# Altium schematic sheet 电路图.SchDoc
size A3; PageSetup: Record=PageOptions|CenterHorizontal=True|CenterVertical=True|PrintScale=1.00|XCorrection=1.00|YCorrection=1.00|PrintKind=1|BorderSize=5000000|LeftOffset=0|BottomOffset=0|Orientation=2|PaperLength=1000|PaperWidth=1000|Scale=100|PaperSource=7|PrintQuality=-3|MediaType=1|DitherType=10|PrintScaleMode=0|PaperKind=A4|PaperIndex=9
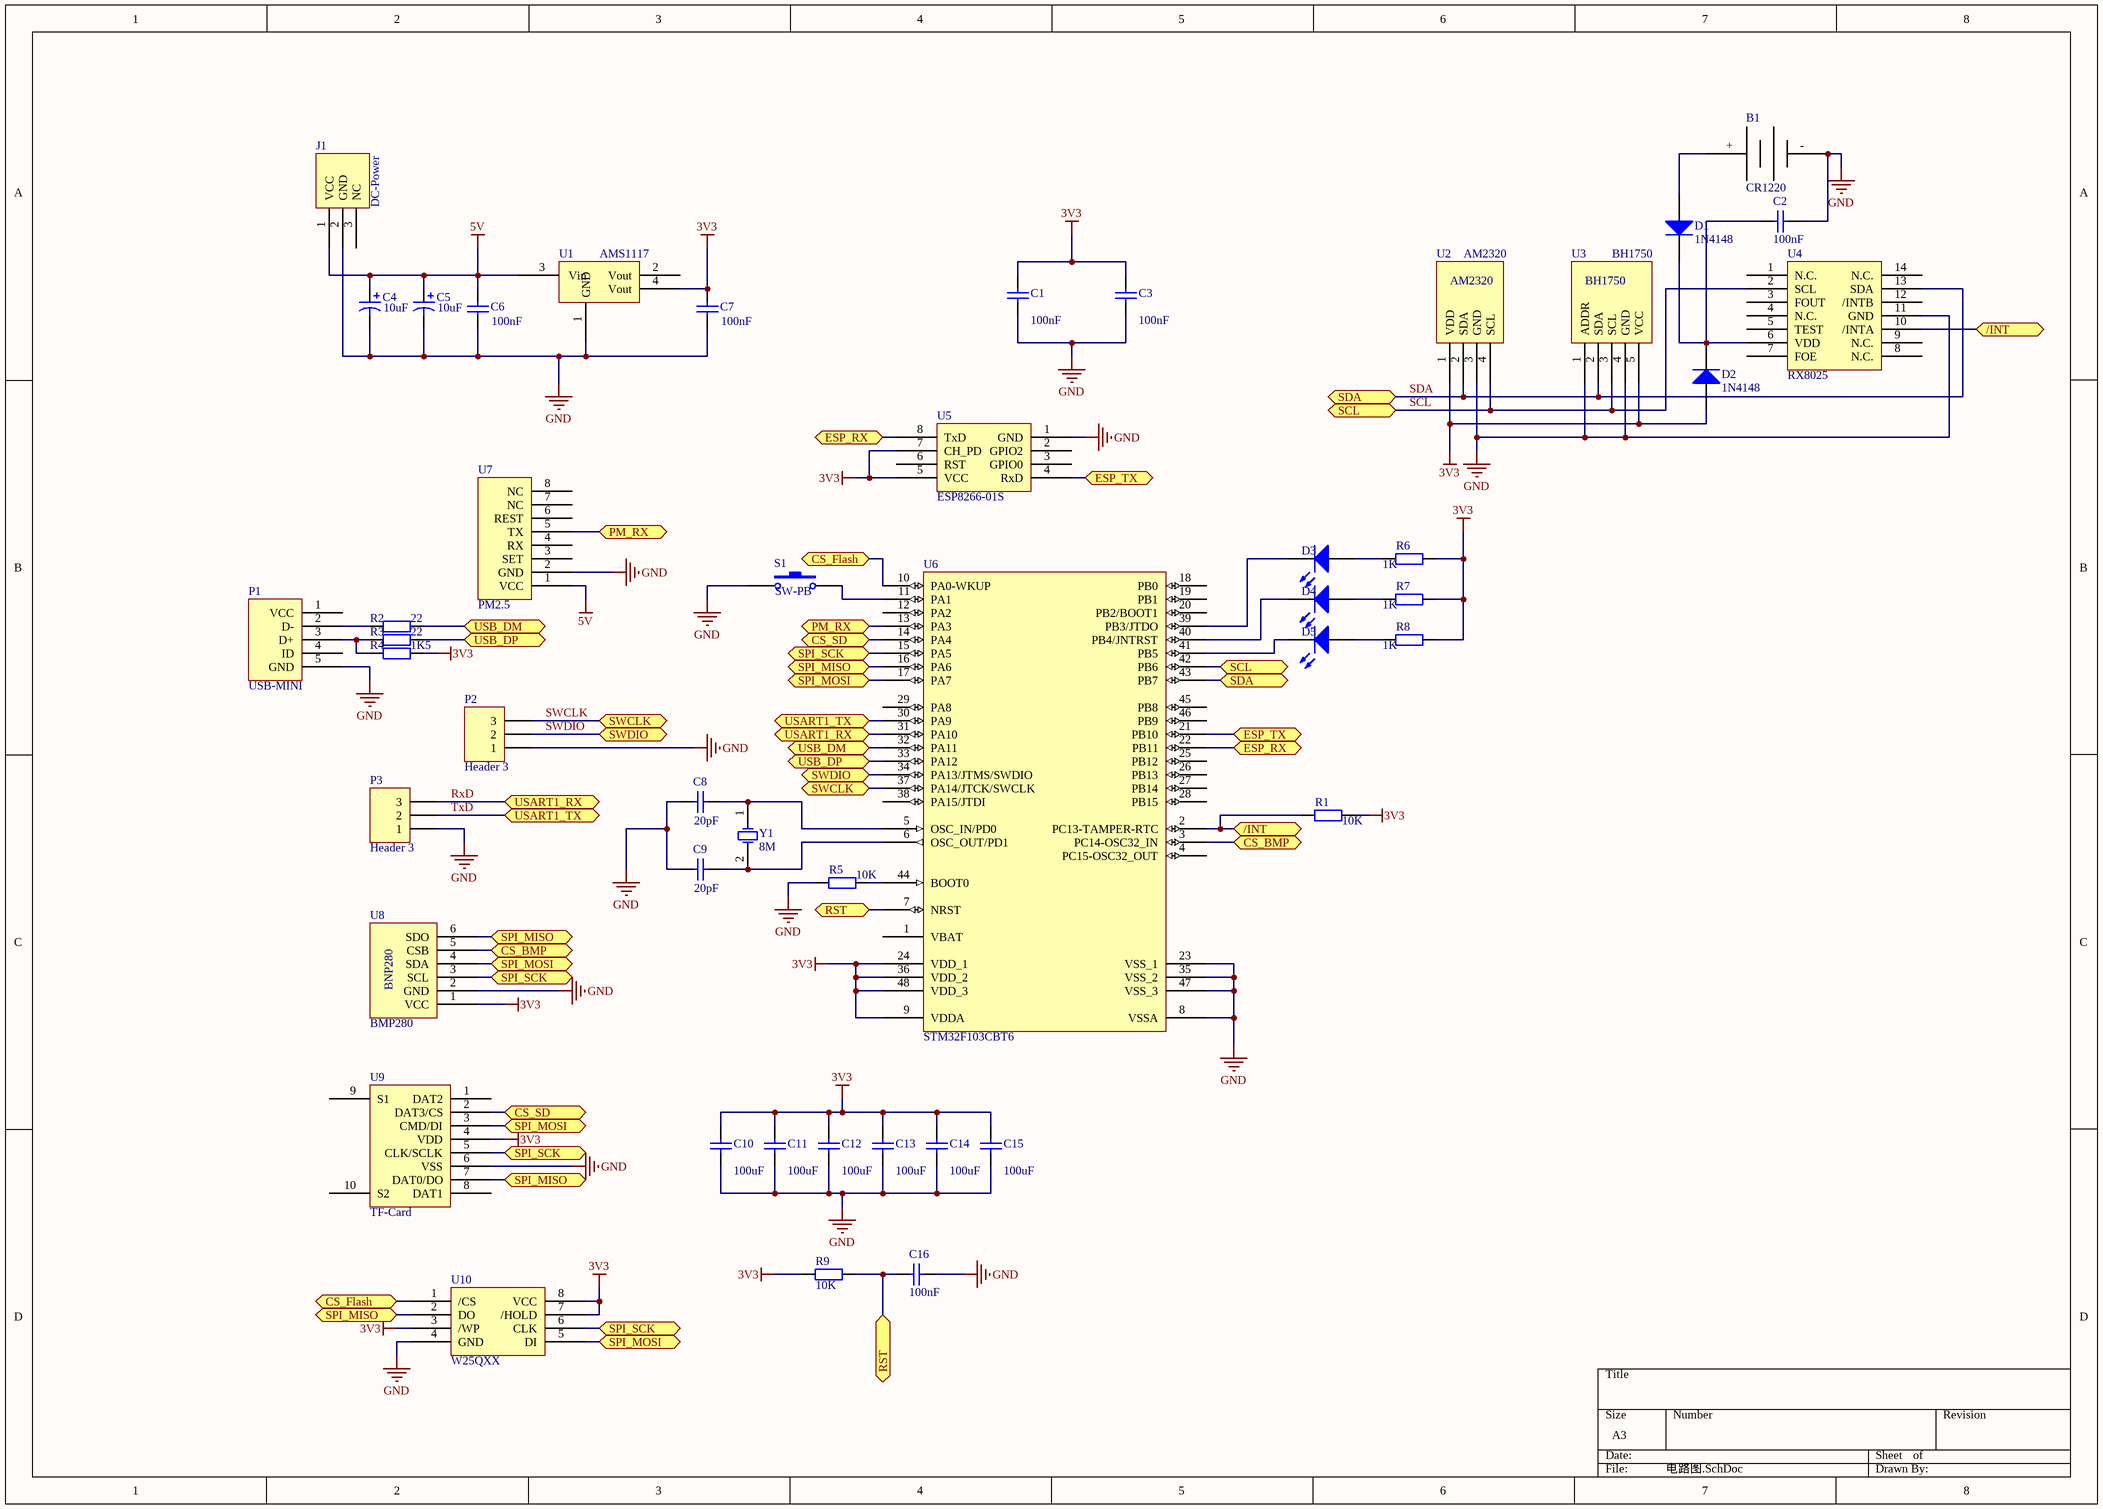
[diagram p0: 电路图.SchDoc]

## Parts
B1  CR1220  [CR1220]
C1  value 100nF  [1608[0603]]  (hidden comment: Cap)
C2  value 100nF  [1608[0603]]  (hidden comment: Cap)
C3  value 100nF  [1608[0603]]  (hidden comment: Cap)
C4  value 10uF  [C1210]  (hidden comment: Cap Pol1)
C5  value 10uF  [C1210]  (hidden comment: Cap Pol1)
C6  value 100nF  [1608[0603]]  (hidden comment: Cap)
C7  value 100nF  [1608[0603]]  (hidden comment: Cap)
C8  value 20pF  [C0805]  (hidden comment: Cap)
C9  value 20pF  [C0805]  (hidden comment: Cap)
C10  value 100uF  [1608[0603]]  (hidden comment: Cap)
C11  value 100uF  [1608[0603]]  (hidden comment: Cap)
C12  value 100uF  [1608[0603]]  (hidden comment: Cap)
C13  value 100uF  [1608[0603]]  (hidden comment: Cap)
C14  value 100uF  [1608[0603]]  (hidden comment: Cap)
C15  value 100uF  [1608[0603]]  (hidden comment: Cap)
C16  value 100nF  [1608[0603]]  (hidden comment: Cap)
D1  1N4148  [DO-35]
D2  1N4148  [DO-35]
D3  LED2  [C0805]  (value not drawn)
D4  LED2  [C0805]  (value not drawn)
D5  LED2  [C0805]  (value not drawn)
J1  DC-Power  [DC-Power]
P1  USB-MINI  [USB-MINI]
P2  Header 3  [HDR1X3]
P3  Header 3  [HDR1X3]
R1  value 10K  [1608[0603]]  (hidden comment: Res2)
R2  value 22  [C0805]  (hidden comment: Res2)
R3  value 22  [C0805]  (hidden comment: Res2)
R4  value 1K5  [C0805]  (hidden comment: Res2)
R5  value 10K  [1608[0603]]  (hidden comment: Res2)
R6  value 1K  [1608[0603]]  (hidden comment: Res2)
R7  value 1K  [1608[0603]]  (hidden comment: Res2)
R8  value 1K  [1608[0603]]  (hidden comment: Res2)
R9  value 10K  [1608[0603]]  (hidden comment: Res2)
S1  SW-PB  [KEY]
U1  AMS1117  [SOT223_N]
U2  AM2320  [HDR1X4]
U3  BH1750  [HDR1X5]
U4  RX8025  [SOP14]
U5  ESP8266-01S  [ESP-8P]
U6  STM32F103CBT6  [LQFP48_L]
U7  PM2.5  [PT-8P]
U8  BMP280  [HDR1X6]
U9  TF-Card  [TF-Card]
U10  W25QXX  [SOIC8]
Y1  8M  [OSC]

## Ports
/INT, CS_BMP, CS_Flash, CS_SD, ESP_RX, ESP_TX, PM_RX, RST, SCL, SDA, SPI_MISO, SPI_MOSI, SPI_SCK, SWCLK, SWDIO, USART1_RX, USART1_TX, USB_DM, USB_DP

## Nets
3V3: C1.2 C3.2 C7.2 C10.2 C11.2 C12.2 C13.2 C14.2 C15.2 D2.1(A) R1.2 R4.1 R6.2 R7.2 R8.2 R9.2 U1.4(Vout) U2.1(VDD) U3.5(VCC) U5.5(VCC) U5.7(CH_PD) U6.9(VDDA) U6.24(VDD_1) U6.36(VDD_2) U6.48(VDD_3) U8.1(VCC) U9.4(VDD) U10.3(/WP) U10.7(/HOLD) U10.8(VCC)
5V: C4.1 C5.1 C6.2 J1.1(VCC) U1.3(Vin) U7.1(VCC)
GND: B1.- C1.1 C2.1 C3.1 C4.2 C5.2 C6.1 C7.1 C8.1 C9.1 C10.1 C11.1 C12.1 C13.1 C14.1 C15.1 C16.1 J1.2(GND) P1.5(GND) P2.1 P3.1 R5.1 S1.1 U1.1(GND) U2.3(GND) U3.1(ADDR) U3.4(GND) U4.11(GND) U5.1(GND) U6.8(VSSA) U6.23(VSS_1) U6.35(VSS_2) U6.47(VSS_3) U7.2(GND) U8.2(GND) U9.6(VSS) U10.4(GND)
/INT: R1.1 U4.10(/INTA) U6.2(PC13-TAMPER-RTC) ; port /INT
CS_BMP: U6.3(PC14-OSC32_IN) U8.5(CSB) ; port CS_BMP
CS_Flash: U6.10(PA0-WKUP) U10.1(/CS) ; port CS_Flash
CS_SD: U6.14(PA4) U9.2(DAT3/CS) ; port CS_SD
ESP_RX: U5.8(TxD) U6.22(PB11) ; port ESP_RX
ESP_TX: U5.4(RxD) U6.21(PB10) ; port ESP_TX
PM_RX: U6.13(PA3) U7.5(TX) ; port PM_RX
RST: C16.2 R9.1 U6.7(NRST) ; port RST
RxD: P3.3 U6.31(PA10) ; port USART1_RX
SCL: U2.4(SCL) U3.3(SCL) U4.2(SCL) U6.42(PB6) ; port SCL
SDA: U2.2(SDA) U3.2(SDA) U4.13(SDA) U6.43(PB7) ; port SDA
SPI_MISO: U6.16(PA6) U8.6(SDO) U9.7(DAT0/DO) U10.2(DO) ; port SPI_MISO
SPI_MOSI: U6.17(PA7) U8.4(SDA) U9.3(CMD/DI) U10.5(DI) ; port SPI_MOSI
SPI_SCK: U6.15(PA5) U8.3(SCL) U9.5(CLK/SCLK) U10.6(CLK) ; port SPI_SCK
SWCLK: P2.3 U6.37(PA14/JTCK/SWCLK) ; port SWCLK
SWDIO: P2.2 U6.34(PA13/JTMS/SWDIO) ; port SWDIO
TxD: P3.2 U6.30(PA9) ; port USART1_TX
USB_DM: R2.2 U6.32(PA11) ; port USB_DM
USB_DP: R3.2 U6.33(PA12) ; port USB_DP
NetB1_+: B1.+ D1.1(A)
NetC2_2: C2.2 D1.2(K) D2.2(K) U4.6(VDD)
NetC8_2: C8.2 U6.5(OSC_IN/PD0) Y1.1(OSC1)
NetC9_2: C9.2 U6.6(OSC_OUT/PD1) Y1.2(OSC2)
NetD3_1: D3.1(A) R6.1
NetD3_2: D3.2(K) U6.39(PB3/JTDO)
NetD4_1: D4.1(A) R7.1
NetD4_2: D4.2(K) U6.40(PB4/JNTRST)
NetD5_1: D5.1(A) R8.1
NetD5_2: D5.2(K) U6.41(PB5)
NetP1_2: P1.2(D-) R2.1
NetP1_3: P1.3(D+) R3.1 R4.2
NetR5_2: R5.2 U6.44(BOOT0)
NetS1_2: S1.2 U6.11(PA1)

Not connected (* = marked no-connect by the designer): J1 3(NC); P1 1(VCC) 4(ID); U1 2(Vout); U4 1(N.C.) 3(FOUT) 4(N.C.) 5(TEST) 7(FOE) 8(N.C.) 9(N.C.) 12(/INTB) 14(N.C.); U5 2(GPIO2) 3(GPIO0) 6(RST); U6 1(VBAT) 4(PC15-OSC32_OUT) 12(PA2) 18(PB0) 19(PB1) 20(PB2/BOOT1) 25(PB12) 26(PB13) 27(PB14) 28(PB15) 29(PA8) 38(PA15/JTDI) 45(PB8) 46(PB9); U7 3(SET) 4(RX) 6(REST) 7(NC) 8(NC); U9 1(DAT2) 8(DAT1) 9(S1) 10(S2)

## Notes on the sheet
- (in symbol BMP280) BNP280

## Library data of the parts
B1 = CR1220: CR1220电池; pin to pad: +>1 ->2
C1-C3 C6-C16 = Cap: Capacitor; Published: 8-Jun-2000; LatestRevisionDate: 17-Jul-2002; LatestRevisionNote: Re-released for DXP Platform.; PackageReference: RAD-0.3; Publisher: Altium Limited; PackageDescription: Radial Cap, Thru-Hole; 2 Leads; 0.3 in Pin Spacing
C4 C5 = Cap Pol1: Polarized Capacitor (Radial); Published: 8-Jun-2000; LatestRevisionDate: 17-Jul-2002; LatestRevisionNote: Re-released for DXP Platform.; PackageReference: RB7.6-15; Publisher: Altium Limited; PackageDescription: Polarized Capacitor (Radial); 2 Leads
D1 D2 = Diode 1N4148: High Conductance Fast Diode; Published: 8-Jun-2000; LatestRevisionDate: 17-Jul-2002; LatestRevisionNote: Re-released for DXP Platform.; DatasheetVersion: 1997; PackageReference: DO-35; Publisher: Altium Limited; PackageDescription: Diode, Axial; Body 3.8 x 1.9 mm (LxDia. max), Lead Dia. 0.53 mm (max); Code_JEDEC: DO-204-AH; ComponentLink1Description: Manufacturer Link; ComponentLink1URL: http://www.fairchildsemi.com/; ComponentLink2Description: Datasheet; ComponentLink2URL: http://www.fairchildsemi.com/ds/1N%2F1N4148.pdf
D3-D5 = LED2: Typical RED, GREEN, YELLOW, AMBER GaAs LED; Published: 8-Jun-2000; LatestRevisionDate: 17-Jul-2002; LatestRevisionNote: Re-released for DXP Platform.; PackageVersion: Feb-2002; PackageReference: 3.2X1.6X1.1; Publisher: Altium Limited; PackageDescription: SM LED; 2 Flat Leads
P1 = USB-MINI: USB接口
P2 P3 = Header 3: Header, 3-Pin; LatestRevisionDate: 17-Jul-2002; LatestRevisionNote: Re-released for DXP Platform.; Publisher: Altium Limited
R1-R9 = Res2: Resistor; Published: 8-Jun-2000; LatestRevisionDate: 17-Jul-2002; LatestRevisionNote: Re-released for DXP Platform.; PackageReference: AXIAL-0.4; Publisher: Altium Limited; PackageDescription: Axial Device, Thru-Hole; 2 Leads; 0.4 in Pin Spacing
S1 = SW-PB: Switch; Published: 24-Mar-1999; LatestRevisionDate: 17-Jul-2002; LatestRevisionNote: Re-released for DXP Platform.; PackageReference: SPST-2; Publisher: Altium Limited; PackageDescription: Switch; 2 Leads
U1 = AMS1117: 稳压IC
U2 = AM2320: AM2320温湿度传感器
U3 = BH1750: 光照强度传感器
U4 = RX8025: RTC芯片
U5 = ESP8266-01S: WIFI模块
U6 = STM32F103CBT6: STM32 ARM-based 32-bit MCU with 128 Kbytes Flash, 48-pin LQFP, Industrial Temperature; Published: 30-May-2008; DatasheetVersion: rev6, Mar-2008; PackageVersion: Mar-2008; PackageReference: LQFP48; Publisher: Altium Limited; PackageDescription: 48-Pin Low-Profile Quad Flat Pack, 7 x 7 mm Body, 0.5 mm Pitch (LQFP48); ComponentLink1Description: Manufacturer Link; ComponentLink1URL: www.st.com/stm32; ComponentLink2Description: Datasheet; ComponentLink2URL: http://www.st.com/stonline/products/literature/ds/13587.pdf
U7 = PM2.5: PM2.5传感器
U8 = BMP280: 大气压传感器
U9 = TF-Card: TF存储卡
U10 = W25QXX: SPI-Flash
Y1 = XTAL: Crystal Oscillator; Published: 8-Jun-2000; LatestRevisionDate: 17-Jul-2002; LatestRevisionNote: Re-released for DXP Platform.; PackageReference: R38; Publisher: Altium Limited; PackageDescription: Crystal, Thru-Hole; 2 Leads; Body 3.1 x 8.2 mm (Dia.xH)